# EAGLE design Adafruit ADXL345 Triple-Axis Accelerometer (EAGLE 9.6.2)
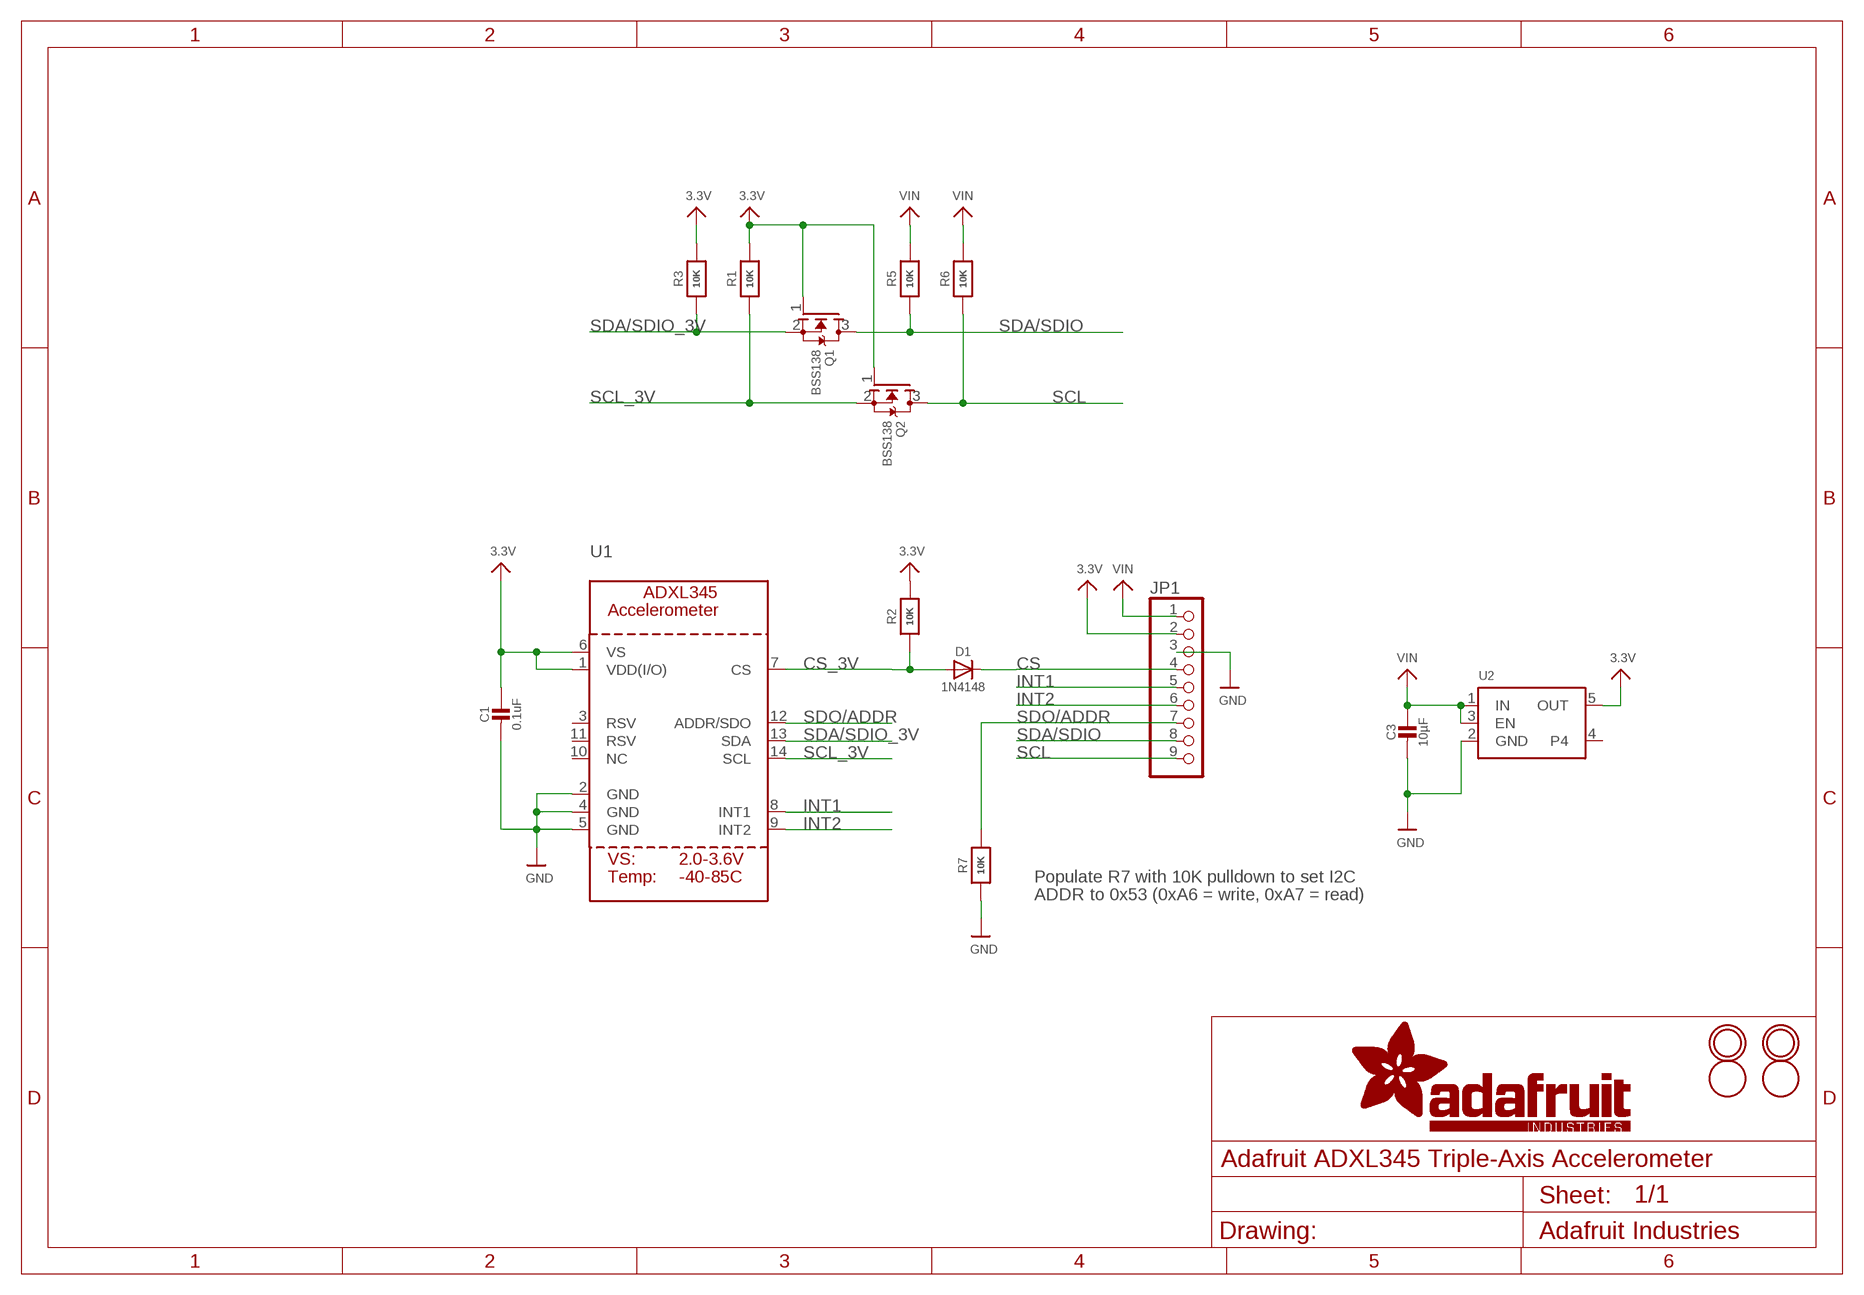
[diagram p0: schematic, sheet 1]

## Parts
C1  0.1uF  CAP_CERAMIC0805-NOOUTLINE  [0805-NO]
C3  10µF  CAP_CERAMIC0805-NOOUTLINE  [0805-NO]
D1  1N4148  DIODE_SOD323MINI  [SOD-323_MINI]
JP1  HEADER-1X970MIL  [1X09_ROUND_70]
Q1  BSS138  MOSFET-NWIDE  [SOT23-WIDE]
Q2  BSS138  MOSFET-NWIDE  [SOT23-WIDE]
R1  10K  RESISTOR0805_NOOUTLINE  [0805-NO]
R2  10K  RESISTOR0805_NOOUTLINE  [0805-NO]
R3  10K  RESISTOR0805_NOOUTLINE  [0805-NO]
R5  10K  RESISTOR0805_NOOUTLINE  [0805-NO]
R6  10K  RESISTOR0805_NOOUTLINE  [0805-NO]
R7  10K  RESISTOR0805_NOOUTLINE  [0805-NO]
U1  ACCEL_ADXL345  [LGA14]
U2  VREG_SOT23-5  [SOT23-5]
U$1  FIDUCIAL  [FIDUCIAL_1MM]
U$3  FIDUCIAL  [FIDUCIAL_1MM]
U$4  MOUNTINGHOLE2.5  [MOUNTINGHOLE_2.5_PLATED]
U$6  MOUNTINGHOLE2.5  [MOUNTINGHOLE_2.5_PLATED]

## Nets
3.3V: C1.1 JP1.2 Q1.1(G) Q2.1(G) R1.2 R2.2 R3.2 U1.1(VDD(I/O)) U1.6(VS) U2.5(OUT)
CS: D1.C JP1.4
CS_3V: D1.A R2.1 U1.7(CS)
GND: C1.2 C3.2 JP1.3 R7.1 U1.2(GND) U1.4(GND) U1.5(GND) U2.2(GND)
INT1: JP1.5 U1.8(INT1)
INT2: JP1.6 U1.9(INT2)
SCL: JP1.9 Q2.3(D) R6.1
SCL_3V: Q2.2(S) R1.1 U1.14(SCL)
SDA/SDIO: JP1.8 Q1.3(D) R5.1
SDA/SDIO_3V: Q1.2(S) R3.1 U1.13(SDA)
SDO/ADDR: JP1.7 R7.2 U1.12(ADDR/SDO)
VIN: C3.1 JP1.1 R5.2 R6.2 U2.1(IN) U2.3(EN)
Unconnected: U1.3(RSV) U1.10(NC) U1.11(RSV) U2.4

## Notes on the sheet
- Populate R7 with 10K pulldown to set I2C
- ADDR to 0x53 (0xA6 = write, 0xA7 = read)

## Library data of the parts
C1 C3 = microbuilder:CAP_CERAMIC: Ceramic Capacitors For new designs, use the packages preceded by an '_' character since they are more reliable: The following footprints should be used on most boards: _0402 - Standard footprint for regular board layouts _0603 - Standard footprint for regular board layouts _0805 - Standard footprint for regular board layouts _1206 - Standard footprint for regular board layouts For extremely tight-pitch boards where space is at a premium, the following 'micro-pitch' footprints can be used (smaller pads, no silkscreen outline, etc.): _0402MP - Micro-pitch footprint for very dense/compact boards _0603MP - Micro-pitch footprint for very dense/compact boards _0805MP - Micro-pitch footprint for very dense/compact boards _1206MP - Micro-pitch footprint for very dense/compact boards
D1 = microbuilder:DIODE: Diode SMA Model Volts Amps Type Vf Ir Digikey # Notes SSA34-E3 40V 3A Schottky 480mV @ 3A 200uA @ 40V SSA34-E3/61TGITR-ND CDBA120-G 20V 1A Schottky 500mV @ 1A 500uA @ 20V 641-1014-6-ND REEL MBRA210 10V 2A Schottky 350mV @ 2A 700uA @ 10V MBRA210LT3 SOD-123 Model Volts Amps Type Vf Ir Order # Notes BAT54T1G 30V 200mA Schottky 800mV @ 200mA 2uA @ 25V BAT54T1GOSTR-ND B0530W 30V 500mA Schottky 430mV @ 500mA 130uA @ 30V B0530W-FDICT-ND REEL MBR120 20V 1A Schottky 340mV @ 1A MBR120VLSFT1GOSCT-ND SOD-323 Model Volts Amps Type Vf Ir Order # Notes PMEG2005EJ 20V 500mA Schottky 355mV @ 500mA 568-4110-1-ND ZLLS410 10V 570mA Schottky 380mV @ 570mA ZLLS410CT-ND 1N4148WS 75V 150mA Silicon/Simple 1V 1N4148WSFSCT-ND REEL SOD-523 Model Volts Amps Type Vf Ir Order # Notes BAT54XV2 30V 200mA Schottky 0.8V @ 100mA BAT54XV2CT-ND TB751S 30V 30mA Schottky RB751S-40TE61CT-ND SOT23-R/W (R = Solder Paste/Reflow Ovens, W = Hand-Soldering) Model Volts Amps Type Vf Ir Order # Notes BAT54FILM 40V 300mA Schottky 497-7162-1-ND POWERDI-5 Model Volts Amps Type Vf Ir Order # Notes PDS560 60V 5A Schottky 670mV @ 5A 150uA @ 60V PDS560DICT-ND
JP1 = microbuilder:HEADER-1X9: PIN HEADER
Q1 Q2 = microbuilder:MOSFET-N: N-Channel Mosfet LEGEND VDS: Voltage Drain-Source ID: Drain Current RDS(ON): Drain-Source On-State Resistance VGS(TH): Gate-Source Threshold Voltage CISS: Drain-Source Input Capacitance SOT-23 Name VDS ID RDS(ON) VGS(TH) CISS Order Number 2N7002E 60V 260mA 2.5 Ohm 2.5V @ 250uA 26.7pF @ 25V 2N7002ET1GOSTR-ND BSH103 30V 850mA 400 mOhm 400mV @ 1mA 83pF @ 24V BSH103,235-ND BSS138 60V 320mA 1.6 Ohm 1.5V @ 250uA 50pF @ 10V Mouser: 771-BSS138PW115 DMN2075U-7 20V 4.2A 38 mOhm 1V @ 250 uA 594.3pF @ 10V DMN2075U-7DICT-ND * BSS138 good choice for I2C level-shifting POWERPAK 1212-8 Name VDS ID RDS(ON) VGS(TH) CISS Order Number Si7308DN 60V 6A 58 mOhm 3V @ 250uA 665pF @ 15V SI7308DN-T1-E3CT-ND
R1-R3 R5-R7 = microbuilder:RESISTOR: Resistors For new designs, use the packages preceded by an '_' character since they are more reliable: The following footprints should be used on most boards: _0402 - Standard footprint for regular board layouts _0603 - Standard footprint for regular board layouts _0805 - Standard footprint for regular board layouts _1206 - Standard footprint for regular board layouts For extremely tight-pitch boards where space is at a premium, the following 'micro-pitch' footprints can be used (smaller pads, no silkscreen outline, etc.): _0402MP - Micro-pitch footprint for very dense/compact boards _0603MP - Micro-pitch footprint for very dense/compact boards _0805MP - Micro-pitch footprint for very dense/compact boards _1206MP - Micro-pitch footprint for very dense/compact boards
U1 = microbuilder:ACCEL_ADXL345: ADXL345 - Digital 3-Axis Accelerometer (I2C/SPI)
U2 = microbuilder:VREG_SOT23-5: SOT23-5 Fixed Voltage Regulators Part Current Out V Out V In V Dropout θJA (°C/W) TJ (°C) Digikey Part No. ADP121 150mA 3.3V 3.4-5.5V 0.09V @ 150mA -- -- ADP121-AUJZ33R7CT-ND ADP121 150mA 3.0V 3.1-5.5V 0.09V @ 150mA -- -- ADP121-AUJZ30R7CT-ND ADP122 300mA 3.3V 3.4-5.5V 0.085V @ 300mA -- -- ADP122AUJZ-3.3-R7CT-ND ADP1712 300mA 3.3V 3.5-5.5V 0.17V @ 300mA -- -- ADP1712AUJZ-3.3-R7TR-ND AP7311 (Low Cost) 150mA 3.3V 3.5-6V 0.15V @ 150mA -- -- AP7311-33WG-7DICT-ND LD39015M18R 150mA 1.8V 1.9V-5.5V 0.08V @ 100mA -- -- 497-6977-1-ND LP2985A-33DBVR 150mA 3.3V 3.3-16V 0.28V @ 150mA 206 150 296-18479-1-ND MCP1824T-3302E/OT 300mA 3.3V 3.5V-6V 0.2V @ 300mA -- -- MCP1824T-3302E/OTCT-ND MIC5205-2.5YM5 TR 150mA 2.5V 2.7-16V 0.165V @ 150mA -- -- 576-1257-2-ND MIC5205-3.0YM5 TR 150mA 3.0V 3.2V-16V 0.165V @ 150mA -- -- 576-1258-2-ND MIC5205-3.3YM5 TR 150mA 3.3V 3.5V-16V 0.165V @ 150mA -- -- 576-1259-2-ND TPS780330220 150mA 3.3V+2.2V 3.6-5.5V 250mV Max -- -- 296-23332-1-ND TDA3663/N1,135 100mA 3.3V 3.5-45V 0.18V @ 50mA -- -- 568-5343-1-ND Max operating temp can be calculated using θJA, TJ (max junction temperature), and power in watts. Set the "Maximum Ambient Temperature" until it reaches TJ ("Max Junction Temperature"), which is the absolute limit for safe use of the regulator: Heat Sink Temperature Calculator <http://www.daycounter.com/Calculators/Heat-Sink-Temperature-Calculator.phtml> For example, With 12V source into a 3.3V LP2985 and a 30mA load, we are dissipating (12V-3.3V) * 0.03A = 0.261W. With a θJA of 206 °C/W, a TJ of 150°C, and 261mW we can safely use the chip without a heat sink up to 75°C (=147.1°C Junction Temperature).
U$1 U$3 = adafruit:FIDUCIAL: For use by pick and place machines to calibrate the vision/machine, 1mm By microbuilder.eu
U$4 U$6 = microbuilder:MOUNTINGHOLE: Mounting Hole For #2 screws (0.086"/2.18mm width, 0.094"/2.4mm hole) use 2.5mm; BOM: EXCLUDE

## Board
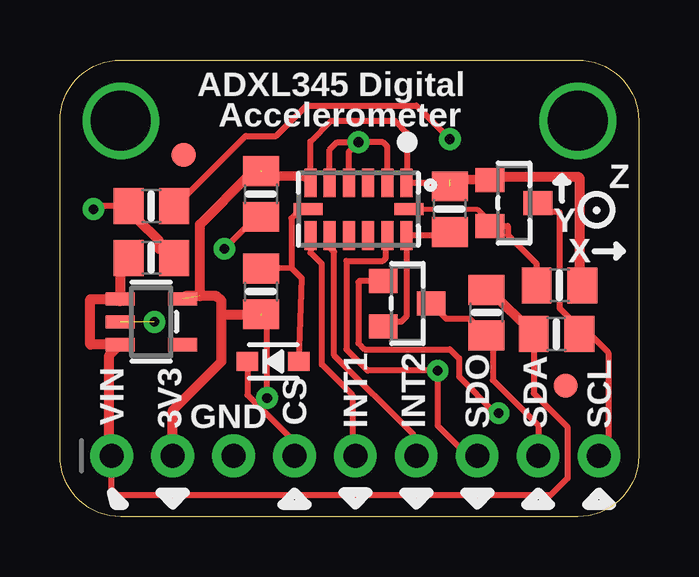
[diagram p1: board, top side]
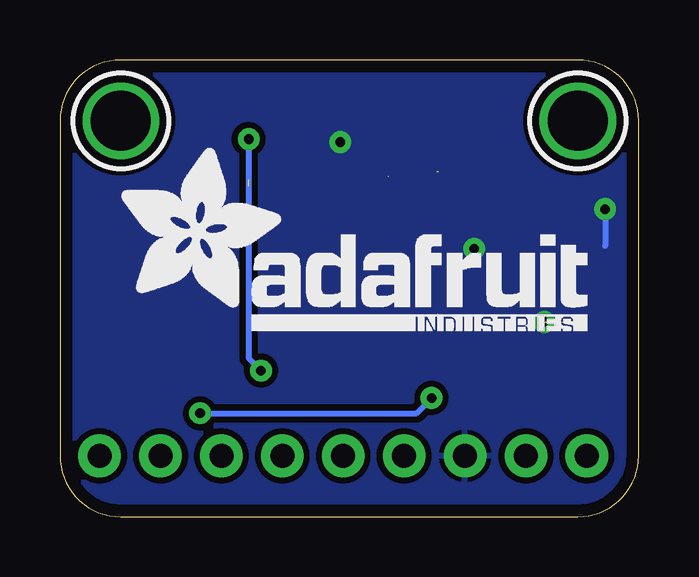
[diagram p2: board, bottom side, seen from below]

Size 24.13 x 19.05 mm. Coordinates in mm from the lower left corner, seen from the top.
Outline: 2.54,19.05 21.59,19.05 arc-90 24.13,16.51 24.13,2.54 arc-90 21.59,0 2.54,0 arc-90 0,2.54 0,16.51 arc-90 2.54,19.05
Copper layers (1*16): Top 0.035mm / dielectric 1.5mm / Bottom 0.035mm
Design rules "default": minimum track width 8mil, minimum drill 0.4mm, track to track 8mil, track to pad 8mil, pad to pad 8mil, via to via 8mil, smd to smd 8mil, copper to edge 20mil, drill to drill 8mil, minimum pad ring 8mil, minimum via ring 10mil, stop-mask expansion 3mil, vias tented up to drill 20mil, thermal gap 8mil

### Footprints (pad centres in the part's own frame; a part is rotated, then mirrored left to right if it is on the bottom)
0805-NO = smd 1.24 x 1.5: 1 -0.95,0; 2 0.95,0
SOD-323_MINI = smd 0.9 x 0.8: A 1.07,0; C -1.07,0
1X09_ROUND_70 = drill 1 pad 1.778: 1 -10.16,0; 2 -7.62,0; 3 -5.08,0; 4 -2.54,0; 5 0,0; 6 2.54,0; 7 5.08,0; 8 7.62,0; 9 10.16,0
SOT23-WIDE = smd 1 x 1.2: 1 -0.95,-1; 2 0.95,-1; 3 0,1
LGA14 = smd 0.5 x 1.2: 1 2,1.1; 2 1.2,1.1; 3 0.4,1.1; 4 -0.4,1.1; 5 -1.2,1.1; 6 -2,1.1; 8 -2,-1.1; 9 -1.2,-1.1; 10 -0.4,-1.1; 11 0.4,-1.1; 12 1.2,-1.1; 13 2,-1.1 | smd 1.2 x 0.5: 7 -2.1,0; 14 2.1,0
SOT23-5 = smd 0.55 x 1.2: 1 -0.95,-1.3; 2 0,-1.3; 3 0.95,-1.3; 4 0.95,1.3; 5 -0.95,1.3
FIDUCIAL_1MM = smd 1 x 1: 1 0,0
MOUNTINGHOLE_2.5_PLATED = drill 2.5 pad 3.2: P$1 0,0

### Placement (x,y rotation side)
C1  8.38,13.46 270 top
C3  3.81,10.79 0 top
D1  8.89,6.48 0 top
JP1  12.32,2.54 0 top
Q1  14.48,8.89 270 top
Q2  18.92,13.08 270 top
R1  20.83,9.65 0 top
R2  8.38,9.4 270 top
R3  16.26,12.83 90 top
R5  17.78,8.51 90 top
R6  20.7,7.62 180 top
R7  3.81,12.95 0 top
U1  12.45,12.83 0 top
U2  3.81,8.13 270 top
U$1  5.16,15.09 0 top
U$3  21.08,5.46 0 top
U$4  21.59,16.51 0 bottom
U$6  2.54,16.51 0 bottom
U$7  [ADAFRUIT_TEXT_20MM]  21.72,7.75 0 bottom

### Tracks (layer width: path | path; a pad name or v marks a point on that pad's centre or on a via)
3.3V  (via drill 0.4)  (8 unrouted)
  Top 0.254: Q1.1 12.51,9.84 12.45,9.78 12.45,7.24 12.7,6.99 16.26,6.99 16.64,6.6 16.64,5.84 18.16,4.32 v18.29,4.32 | v8.64,4.95 8.64,8.14 8.37,8.44 | R3.2 16.26,13.93 U1.1 14.48,14.34 14.48,16 13.97,16.51 11.3,16.51 10.45,15.65 10.45,14.18
  Top 0.406: U2.5 5.24,9.21 5.84,9.21 | 5.84,9.21 5.84,12.19 7.87,14.22 8.29,14.22 8.41,14.39 | 16.14,14.17 16.27,14.04 | 16.26,14.06 17.87,14.08 Q2.1 18.05,14.16 21.65,14.16 21.65,9.78 R1.2 | 10.44,14.19 10.29,14.19 | 10.29,14.19 8.53,14.21 8.36,14.39 | JP1.2 4.7,4.45 6.73,6.48 6.73,8.51 | 6.73,8.51 6.73,9.01 6.54,9.21 5.84,9.21 | 8.38,8.42 6.84,8.42 6.73,8.51 | U1.6 10.38,14.09 arc-90 10.29,14.19
  Bottom 0.254: v18.29,4.32 9.27,4.32 v8.64,4.95
CS
  Top 0.254: JP1.4 10.36,2.54 7.82,5.08 D1.C
CS_3V
  Top 0.254: R2.1 9.64,10.4 | 9.64,10.4 9.65,10.41 9.65,12.45 10.11,12.9 10.22,12.83 U1.7 | D1.A 10.09,9.94 9.64,10.4
GND  (via drill 0.4)  (1 unrouted)
  Top 0.254: C1.2 8.19,12.51 v6.86,11.18 | R7.1 1.52,12.95 v1.4,12.83 | 4.12,11.38 4.12,11.18 4.51,10.79 C3.2 | U1.5 11.25,15.31 11.56,15.62 v12.45,15.62 | U1.4 12.05,15.22 v12.45,15.62 | U1.2 13.65,15.44 13.46,15.62 v12.45,15.62
  Top 0.406: R7.1 3.23,12.59 3.23,12.42 4.12,11.52 4.12,11.18
  Bottom 0.254: v6.86,11.18 6.86,11.43 | v1.4,12.83 1.4,11.3
  other vias: 3.94,8.13
  pour Bottom (isolate 0.254): 0,19.05 24.13,19.05 24.13,0 0,0
INT1
  Top 0.254: JP1.5 12.19,2.67 12.19,5.08 10.92,6.35 10.92,10.54 10.45,11.02 U1.8
INT2
  Top 0.254: JP1.6 14.73,2.67 14.73,3.43 11.43,6.73 11.43,11.05 11.25,11.23 U1.9
SCL
  Top 0.254: JP1.9 22.86,2.92 22.86,6.86 22.1,7.62 R6.1 21.65,7.87 20.83,8.7 20.83,12.7 20.3,12.7 Q2.3
SCL_3V
  Top 0.203: U1.14 17.4,12.83 18.01,12.22
  Top 0.254: 18.03,12.32 18.03,12.24 18.01,12.22 Q2.2 18.67,12.13 18.67,11.75 19.88,10.54 R1.1 | U1.14
SDA/SDIO
  Top 0.254: JP1.8 19.94,3.81 18.05,5.7 18.05,7.29 R5.1 17.08,8.26 16.11,8.26 Q1.3
SDA/SDIO_3V
  Top 0.254: R3.1 16.19,11.81 15.95,11.43 15.89,11.73 U1.13 14.45,8.35 14.22,8.13 13.67,8.13 Q1.2
SDO/ADDR  (via drill 0.4)  (1 unrouted)
  Top 0.254: v16.26,15.75 14.86,17.14 10.29,17.14 9.02,15.88 7.75,15.88 4.83,12.95 R7.2 | JP1.7 17.02,2.54 15.75,3.81 v15.75,6.1 12.83,6.1 11.94,6.99 11.94,10.67 13.46,10.67 13.59,10.79 13.59,12.11 U1.12
  Bottom 0.254: v16.26,15.75 16.26,6.6 v15.75,6.1
VIN
  Top 0.254: JP1.1 2.16,1.14 2.41,0.89 20.45,0.89 21.16,1.6 21.16,3.75 19.75,5.15 R6.2
  Top 0.406: R6.2 17.91,9.46 R5.2 | U2.1 2.51,8.99 | JP1.1 2.03,2.67 2.03,6.7 U2.3 1.27,7.18 1.27,9.08 U2.1 | C3.1 2.51,10.45 U2.1

### Text on the board
tPlace: ADXL345 Digital | Accelerometer | Z | Y | X | GND | VIN | 3V3 | CS | INT1 | INT2 | SDO | SDA | SCL